# EasyEDA schematic SCH_ART-BadgeV2.0.json
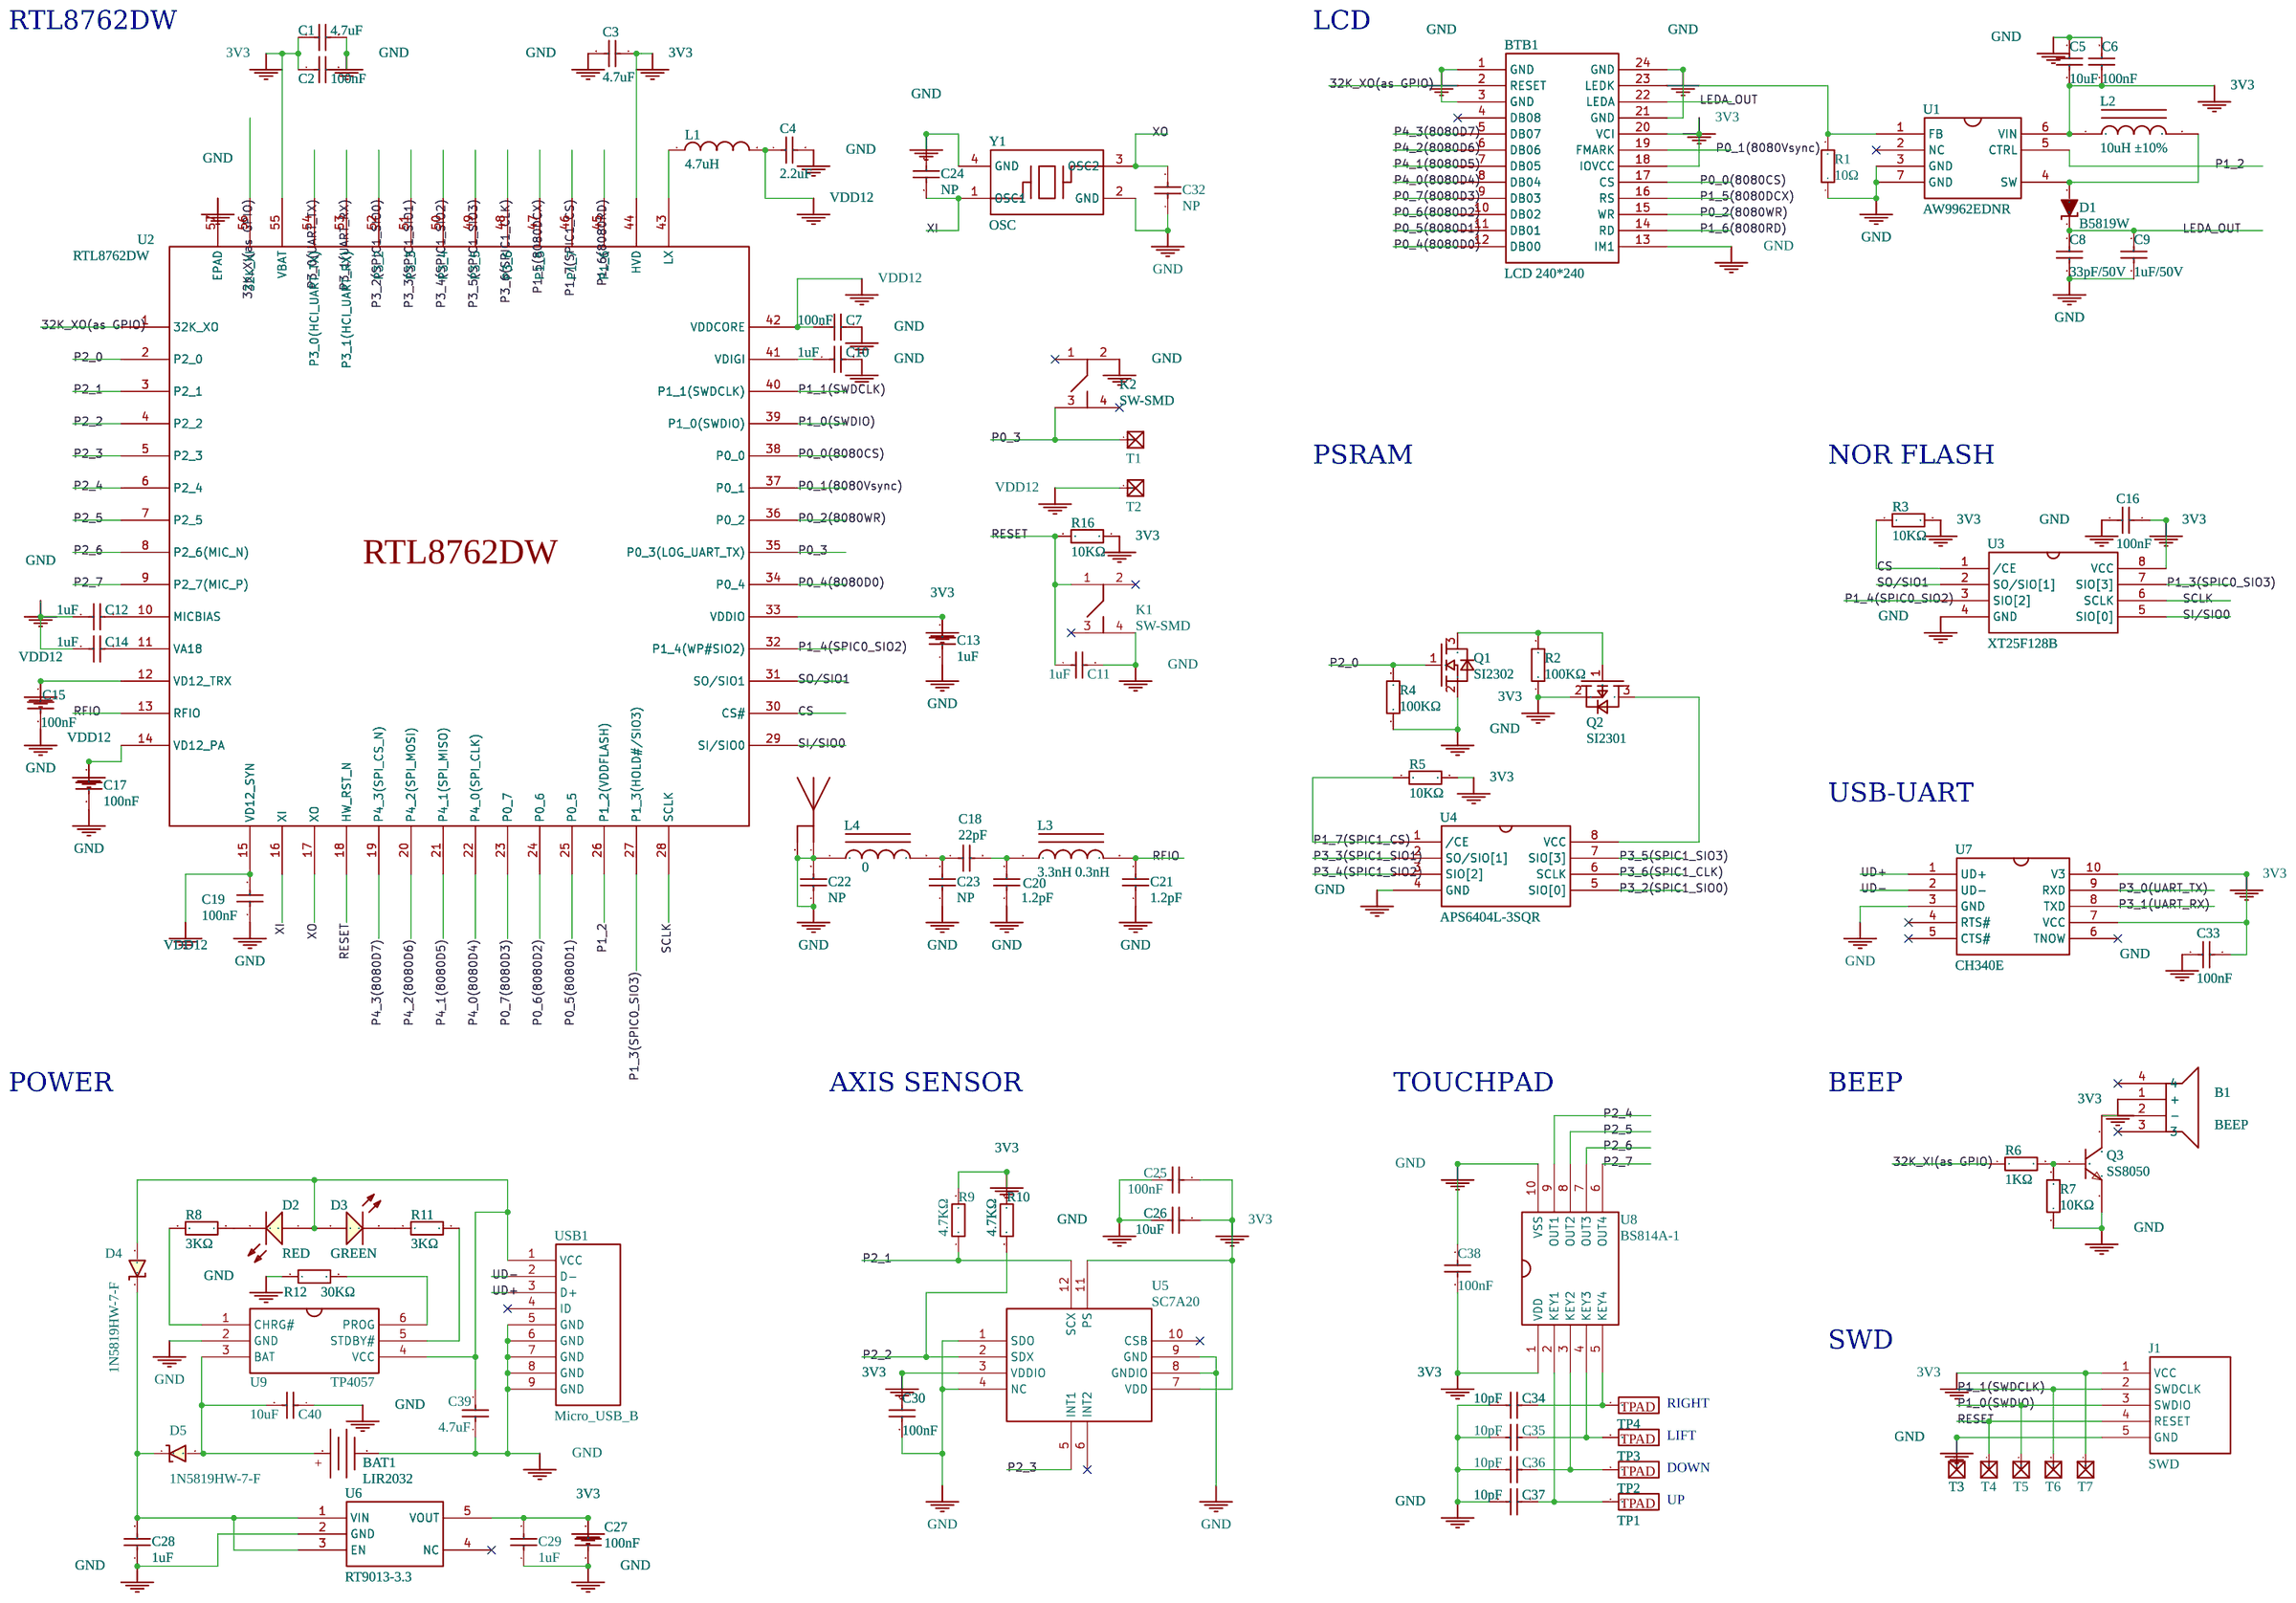
[diagram p0: schematic sheet]

## Parts
*  antenna  [ANT-PCB_1]
B1  BEEP  [BUZ-SMD_4P-L7.5-W7.5-P7.59-BR]
BAT1  LIR2032  [BAT-TH_CR2032-BS-6-1]
BTB1  LCD 240*240  [CONN-SMD_DF37NC-24DS-0.4V(51) 2]
C1  4.7uF  [0402_C]
C2  100nF  [0402_C]
C3  4.7uF  [0402_C]
C4  2.2uF  [0402_C]
C5  10uF  [0402_C]
C6  100nF  [0402_C]
C7  100nF  [0402_C]
C8  33pF/50V  [0402_C]
C9  1uF/50V  [0603_C]
C10  1uF  [0402_C]
C11  1uF  [0402_C]
C12  1uF  [0402_C]
C13  1uF  [0402_C]
C14  1uF  [0402_C]
C15  100nF  [0402_C]
C16  100nF  [0402_C]
C17  100nF  [0402_C]
C18  22pF  [0402_C]
C19  100nF  [0402_C]
C20  1.2pF  [0402_C]
C21  1.2pF  [0402_C]
C22  NP  [0402_C]
C23  NP  [0402_C]
C24  NP  [0402_C]
C25  100nF  [0402_C]
C26  10uF  [0402_C]
C27  100nF  [0402_C]
C28  1uF  [0402_C]
C29  1uF  [0402_C]
C30  100nF  [0402_C]
C32  NP  [0402_C]
C33  100nF  [0402_C]
C34  10pF  [0402_C]
C35  10pF  [0402_C]
C36  10pF  [0402_C]
C37  10pF  [0402_C]
C38  100nF  [0402_C]
C39  4.7uF  [0402_C]
C40  10uF  [0402_C]
D1  B5819W  [SOD-123_L2.8-W1.8-LS3.7-RD]
D2  RED  [0603_LED_S1]
D3  GREEN  [0603_LED_S1]
D4  1N5819HW-7-F  [SOD-123_L2.8-W1.8-LS3.7-RD]
D5  1N5819HW-7-F  [SOD-123_L2.8-W1.8-LS3.7-RD]
J1  SWD  [HDR1X5]
K1  SW-SMD  [SW-SMD_4P-L5.1-W5.1-P3.70-LS6.4]
K2  SW-SMD  [SW-SMD_4P-L5.1-W5.1-P3.70-LS6.4]
L1  4.7uH  [IND-SMD_L2.5-W2.0_WPN252012H]
L2  10uH ±10%  [0603_L]
L3  3.3nH 0.3nH  [0402_L]
L4  0  [0402_L]
Q1  SI2302  [SOT-23-3_L3.0-W1.7-P0.95-LS2.9-BR]
Q2  SI2301  [SOT-23-3_L3.0-W1.7-P0.95-LS2.9-BR]
Q3  SS8050  [SOT-23(SOT-23-3)]
R1  10Ω  [0402_R]
R2  100KΩ  [0402_R]
R3  10KΩ  [0402_R]
R4  100KΩ  [0402_R]
R5  10KΩ  [0402_R]
R6  1KΩ  [0402_R]
R7  10KΩ  [0402_R]
R8  3KΩ  [0402_R]
R9  4.7KΩ  [0402_R]
R10  4.7KΩ  [0402_R]
R11  3KΩ  [0402_R]
R12  30KΩ  [0402_R]
R16  10KΩ  [0402_R]
T1  TEST POINT  [TP_L]
T2  TEST POINT  [TP_L]
T3  TEST POINT  [TP_L]
T4  TEST POINT  [TP_L]
T5  TEST POINT  [TP_L]
T6  TEST POINT  [TP_L]
T7  TEST POINT  [TP_L]
TP1  TPAD  [TPAD - DUPLICATE]
TP2  TPAD  [TPAD - DUPLICATE]
TP3  TPAD  [TPAD - DUPLICATE]
TP4  TPAD  [TPAD - DUPLICATE]
U1  AW9962EDNR  [TDFN-6L_2X2]
U2  RTL8762DW  [QFN56_7X7MM]
U3  XT25F128B  [SOIC-8_L5.3-W5.3-P1.27-LS8.0-BL]
U4  APS6404L-3SQR  [SOP-8_L5.0-W4.0-P1.27-LS6.0-BL]
U5  SC7A20  [LGA-12_L2.0-W2.0-P0.50-BL]
U6  RT9013-3.3  [SOT-23-5_L3.0-W1.7-P0.95-LS2.8-BL]
U7  CH340E  [MSOP-10_L3.0-W3.0-P0.50-LS5.0-BL]
U8  BS814A-1  [MSOP-10_L3.0-W3.0-P0.50-LS5.0-TL]
U9  TP4057  [SOT-23-6_L2.9-W1.6-P0.95-LS2.8-BR]
USB1  Micro_USB_B  [MICRO-USB-SMD_U254-051T-4BH83-F1S]
Y1  OSC  [OSC-SMD_4P-L3.2-W2.5-BL]

## Library data of the parts
C1 C3 C39 C40 = -: ComponentLink1Description: 供应商链接; ComponentLink1URL: http://www.szlcsc.com/product/details_24469.html; Supplier: LC; SuppliersPartNumber: C23733
C2 C6 C7 C15-C17 C19 C25 C27 C30 C33 C38 = -: ComponentLink1Description: 供应商链接; ComponentLink1URL: http://www.szlcsc.com/product/details_1877.html; Supplier: LC; SuppliersPartNumber: C1525
C4 = -: ComponentLink1Description: 供应商链接; ComponentLink1URL: https://item.szlcsc.com/13164.html; Supplier: LC; SuppliersPartNumber: C12530
C5 C26 = -: ComponentLink1Description: 供应商链接; ComponentLink1URL: http://www.szlcsc.com/product/details_16204.html; Supplier: LC; SuppliersPartNumber: C15525
C8 = -: ComponentLink1Description: 供应商链接; ComponentLink1URL: http://www.szlcsc.com/product/details_1914.html; Supplier: LC; SuppliersPartNumber: C1562
C9 = -: ComponentLink1Description: 供应商链接; ComponentLink1URL: http://www.szlcsc.com/product/details_16531.html; Supplier: LC; SuppliersPartNumber: C15849
C10-C14 C24 C28 C29 C32 = -: ComponentLink1Description: 供应商链接; ComponentLink1URL: https://item.szlcsc.com/30018.html; Supplier: LC; SuppliersPartNumber: C29266
C18 = -: ComponentLink1Description: 供应商链接; ComponentLink1URL: http://www.szlcsc.com/product/details_1907.html; Supplier: LC; SuppliersPartNumber: C1555
C20-C23 = -: ComponentLink1Description: 供应商链接; ComponentLink1URL: http://www.szlcsc.com/product/details_1899.html; Supplier: LC; SuppliersPartNumber: C1547
C34-C37 = -: ComponentLink1Description: 供应商链接; ComponentLink1URL: http://www.szlcsc.com/product/details_33914.html; Supplier: LC; SuppliersPartNumber: C32949
D2 = -: ComponentLink1Description: 供应商链接; ComponentLink1URL: http://www.szlcsc.com/product/details_2659.html; Supplier: LC; SuppliersPartNumber: C2286
D3 = -: ComponentLink1Description: 供应商链接; ComponentLink1URL: http://www.szlcsc.com/product/details_73152.html; Supplier: LC; SuppliersPartNumber: C72043
L2 = -: ComponentLink1Description: 供应商链接; ComponentLink1URL: http://www.szlcsc.com/product/details_1387.html; Supplier: LC; SuppliersPartNumber: C1035
L3 L4 = -: ComponentLink1Description: 供应商链接; ComponentLink1URL: http://www.szlcsc.com/product/details_27873.html; Supplier: LC; SuppliersPartNumber: C27124
Q3 = -: ComponentLink1Description: 供应商链接; ComponentLink1URL: http://www.szlcsc.com/product/details_2507.html; Supplier: LC; SuppliersPartNumber: C2150
R1 = -: ComponentLink1Description: 供应商链接; ComponentLink1URL: http://www.szlcsc.com/product/details_25820.html; Supplier: LC; SuppliersPartNumber: C25077
R2 R4 = -: ComponentLink1Description: 供应商链接; ComponentLink1URL: http://www.szlcsc.com/product/details_26484.html; Supplier: LC; SuppliersPartNumber: C25741
R3 R5 R7 R16 = -: ComponentLink1Description: 供应商链接; ComponentLink1URL: http://www.szlcsc.com/product/details_26487.html; Supplier: LC; SuppliersPartNumber: C25744
R6 = -: ComponentLink1Description: 供应商链接; ComponentLink1URL: http://www.szlcsc.com/product/details_12256.html; Supplier: LC; SuppliersPartNumber: C11702
R8 R11 = -: ComponentLink1Description: 供应商链接; ComponentLink1URL: http://www.szlcsc.com/product/details_26633.html; Supplier: LC; SuppliersPartNumber: C25890
R9 R10 = -: ComponentLink1Description: 供应商链接; ComponentLink1URL: http://www.szlcsc.com/product/details_26643.html; Supplier: LC; SuppliersPartNumber: C25900
R12 = -: ComponentLink1Description: 供应商链接; ComponentLink1URL: http://www.szlcsc.com/product/details_26498.html; Supplier: LC; SuppliersPartNumber: C25755

## Nets
3V3: B1.1(+) BTB1.18(IOVCC) BTB1.20(VCI) C1.1 C2.1 C3.1 C5.1 C6.1 C13.2 C16.2 C25.1 C26.2 C27.2 C29.2 C30.2 C33.1 C38.1 J1.1(VCC) L2.1 Q2.2 R2.1 R3.2 R5.2 R9.2 R10.2 R16.1 T7.1(TP) U1.6(VIN) U2.33(VDDIO) U2.44(HVD) U2.55(VBAT) U3.8(VCC) U5.3(VDDIO) U5.7(VDD) U5.11(PS) U6.5(VOUT) U7.7(VCC) U7.10(V3) U8.1(VDD)
GND: *.1 *.2 BAT1.2 BTB1.1(GND) BTB1.3(GND) BTB1.13(IM1) BTB1.21(GND) BTB1.24(GND) C1.2 C2.2 C3.2 C4.2 C5.2 C6.2 C7.1 C8.1 C9.1 C10.2 C11.2 C12.1 C13.1 C14.1 C15.2 C16.1 C17.2 C19.1 C20.1 C21.1 C22.1 C22.2 C23.1 C24.2 C25.2 C26.1 C27.1 C28.1 C29.1 C30.1 C32.1 C33.2 C34.2 C35.2 C36.2 C37.2 C38.2 C39.1 C40.1 J1.5(GND) K1.4 K2.2 L4.1 Q1.2 Q3.2(E) R1.1 R4.1 R7.1 R12.1 T3.1(TP) U1.3(GND) U1.7(GND) U2.57(EPAD) U3.4(GND) U4.4(GND) U5.1(SDO) U5.4(NC) U5.8(GNDIO) U5.9(GND) U6.2(GND) U7.3(GND) U8.10(VSS) U9.2(GND) USB1.5(GND) USB1.6(GND) USB1.7(GND) USB1.8(GND) USB1.9(GND) Y1.2(GND) Y1.4(GND)
VDD12: C4.1 C7.2 C15.1 C17.1 C19.2 L1.2 T2.1(TP) U2.12(VD12_TRX) U2.14(VD12_PA) U2.15(VD12_SYN) U2.42(VDDCORE)
32K_XI(as GPIO): R6.1 U2.56(32K_XI)
32K_XO(as GPIO): BTB1.2(RESET) U2.1(32K_XO)
CS: R3.1 U2.30(CS#) U3.1(/CE)
LEDA_OUT: BTB1.22(LEDA) C8.2 C9.2 D1.1
P0_0(8080CS): BTB1.17(CS) U2.38(P0_0)
P0_1(8080Vsync): BTB1.19(FMARK) U2.37(P0_1)
P0_2(8080WR): BTB1.15(WR) U2.36(P0_2)
P0_3: K2.3 T1.1(TP) U2.35(P0_3(LOG_UART_TX))
P0_4(8080D0): BTB1.12(DB00) U2.34(P0_4)
P0_5(8080D1): BTB1.11(DB01) U2.25(P0_5)
P0_6(8080D2): BTB1.10(DB02) U2.24(P0_6)
P0_7(8080D3): BTB1.9(DB03) U2.23(P0_7)
P1_0(SWDIO): J1.3(SWDIO) T5.1(TP) U2.39(P1_0(SWDIO))
P1_1(SWDCLK): J1.2(SWDCLK) T6.1(TP) U2.40(P1_1(SWDCLK))
P1_2: U1.5(CTRL) U2.26(P1_2(VDDFLASH))
P1_3(SPIC0_SIO3): U2.27(P1_3(HOLD#/SIO3)) U3.7(SIO[3])
P1_4(SPIC0_SIO2): U2.32(P1_4(WP#SIO2)) U3.3(SIO[2])
P1_5(8080DCX): BTB1.16(RS) U2.47(P1_5)
P1_6(8080RD): BTB1.14(RD) U2.45(P1_6)
P1_7(SPIC1_CS): R5.1 U2.46(P1_7) U4.1(/CE)
P2_0: Q1.1 R4.2 U2.2(P2_0)
P2_1: R9.1 U2.3(P2_1) U5.12(SCX)
P2_2: R10.1 U2.4(P2_2) U5.2(SDX)
P2_3: U2.5(P2_3) U5.5(INT1)
P2_4: U2.6(P2_4) U8.9(OUT1)
P2_5: U2.7(P2_5) U8.8(OUT2)
P2_6: U2.8(P2_6(MIC_N)) U8.7(OUT3)
P2_7: U2.9(P2_7(MIC_P)) U8.6(OUT4)
P3_0(UART_TX): U2.54(P3_0(HCI_UART_TX)) U7.9(RXD)
P3_1(UART_RX): U2.53(P3_1(HCI_UART_RX)) U7.8(TXD)
P3_2(SPIC1_SIO0): U2.52(P3_2) U4.5(SIO[0])
P3_3(SPIC1_SIO1): U2.51(P3_3) U4.2(SO/SIO[1])
P3_4(SPIC1_SIO2): U2.50(P3_4) U4.3(SIO[2])
P3_5(SPIC1_SIO3): U2.49(P3_5) U4.7(SIO[3])
P3_6(SPIC1_CLK): U2.48(P3_6) U4.6(SCLK)
P4_0(8080D4): BTB1.8(DB04) U2.22(P4_0(SPI_CLK))
P4_1(8080D5): BTB1.7(DB05) U2.21(P4_1(SPI_MISO))
P4_2(8080D6): BTB1.6(DB06) U2.20(P4_2(SPI_MOSI))
P4_3(8080D7): BTB1.5(DB07) U2.19(P4_3(SPI_CS_N))
RESET: C11.1 J1.4(RESET) K1.1 R16.2 T4.1(TP) U2.18(HW_RST_N)
RFIO: C21.2 L3.2 U2.13(RFIO)
SCLK: U2.28(SCLK) U3.6(SCLK)
SI/SIO0: U2.29(SI/SIO0) U3.5(SIO[0])
SO/SIO1: U2.31(SO/SIO1) U3.2(SO/SIO[1])
UD+: U7.1(UD+) USB1.3(D+)
UD-: U7.2(UD-) USB1.2(D-)
XI: C24.1 U2.16(XI) Y1.1(OSC1)
XO: C32.2 U2.17(XO) Y1.3(OSC2)
Net-(B1-2): B1.2(-) Q3.3(C)
Net-(BAT1-1): BAT1.1 C40.2 D5.2 U9.3(BAT)
Net-(BTB1-23): BTB1.23(LEDK) R1.2 U1.1(FB)
Net-(C10-1): C10.1 U2.41(VDIGI)
Net-(C12-2): C12.2 U2.10(MICBIAS)
Net-(C14-2): C14.2 U2.11(VA18)
Net-(C18-1): C18.1 C23.2 L4.2
Net-(C18-2): C18.2 C20.2 L3.1
Net-(C28-2): C28.2 D4.1 D5.1 U6.1(VIN) U6.3(EN)
Net-(C34-1): C34.1 TP4.1 U8.5(KEY4)
Net-(C35-1): C35.1 TP3.1 U8.4(KEY3)
Net-(C36-1): C36.1 TP2.1 U8.3(KEY2)
Net-(C37-1): C37.1 TP1.1 U8.2(KEY1)
Net-(C39-2): C39.2 D2.A D3.A D4.2 U9.4(VCC) USB1.1(VCC)
Net-(D1-2): D1.2 L2.2 U1.4(SW)
Net-(D2-K): D2.K R8.1
Net-(D3-K): D3.K R11.1
Net-(L1-1): L1.1 U2.43(LX)
Net-(Q1-3): Q1.3 Q2.1 R2.2
Net-(Q2-3): Q2.3 U4.8(VCC)
Net-(Q3-1): Q3.1(B) R6.2 R7.2
Net-(R8-2): R8.2 U9.1(CHRG#)
Net-(R11-2): R11.2 U9.5(STDBY#)
Net-(R12-2): R12.2 U9.6(PROG)

Not connected (* = marked no-connect by the designer): B1 3* 4*; BTB1 4(DB08)*; K1 2* 3*; K2 1* 4*; U1 2(NC)*; U5 6(INT2)* 10(CSB)*; U6 4(NC)*; U7 4(RTS#)* 5(CTS#)* 6(TNOW)*; USB1 4(ID)*

## Notes on the sheet
- RTL8762DW
- LCD
- PSRAM
- NOR FLASH
- USB-UART
- POWER
- AXIS SENSOR
- TOUCHPAD
- BEEP
- SWD
- RIGHT
- LIFT
- DOWN
- UP
